# EasyEDA Pro project ProPrj_STM32音响_2025-06-08.epro, schematic Third Test
Board Name: THIRD TEST; Create Date: 2025-04-13; Page Name: 连接电池（保护器）; Project Name: STM32多功能音响; Schematic Name: Schematic3; Update Date: 2025-04-13; Company: 嘉立创EDA; Page Size: A4; Version: V1.0
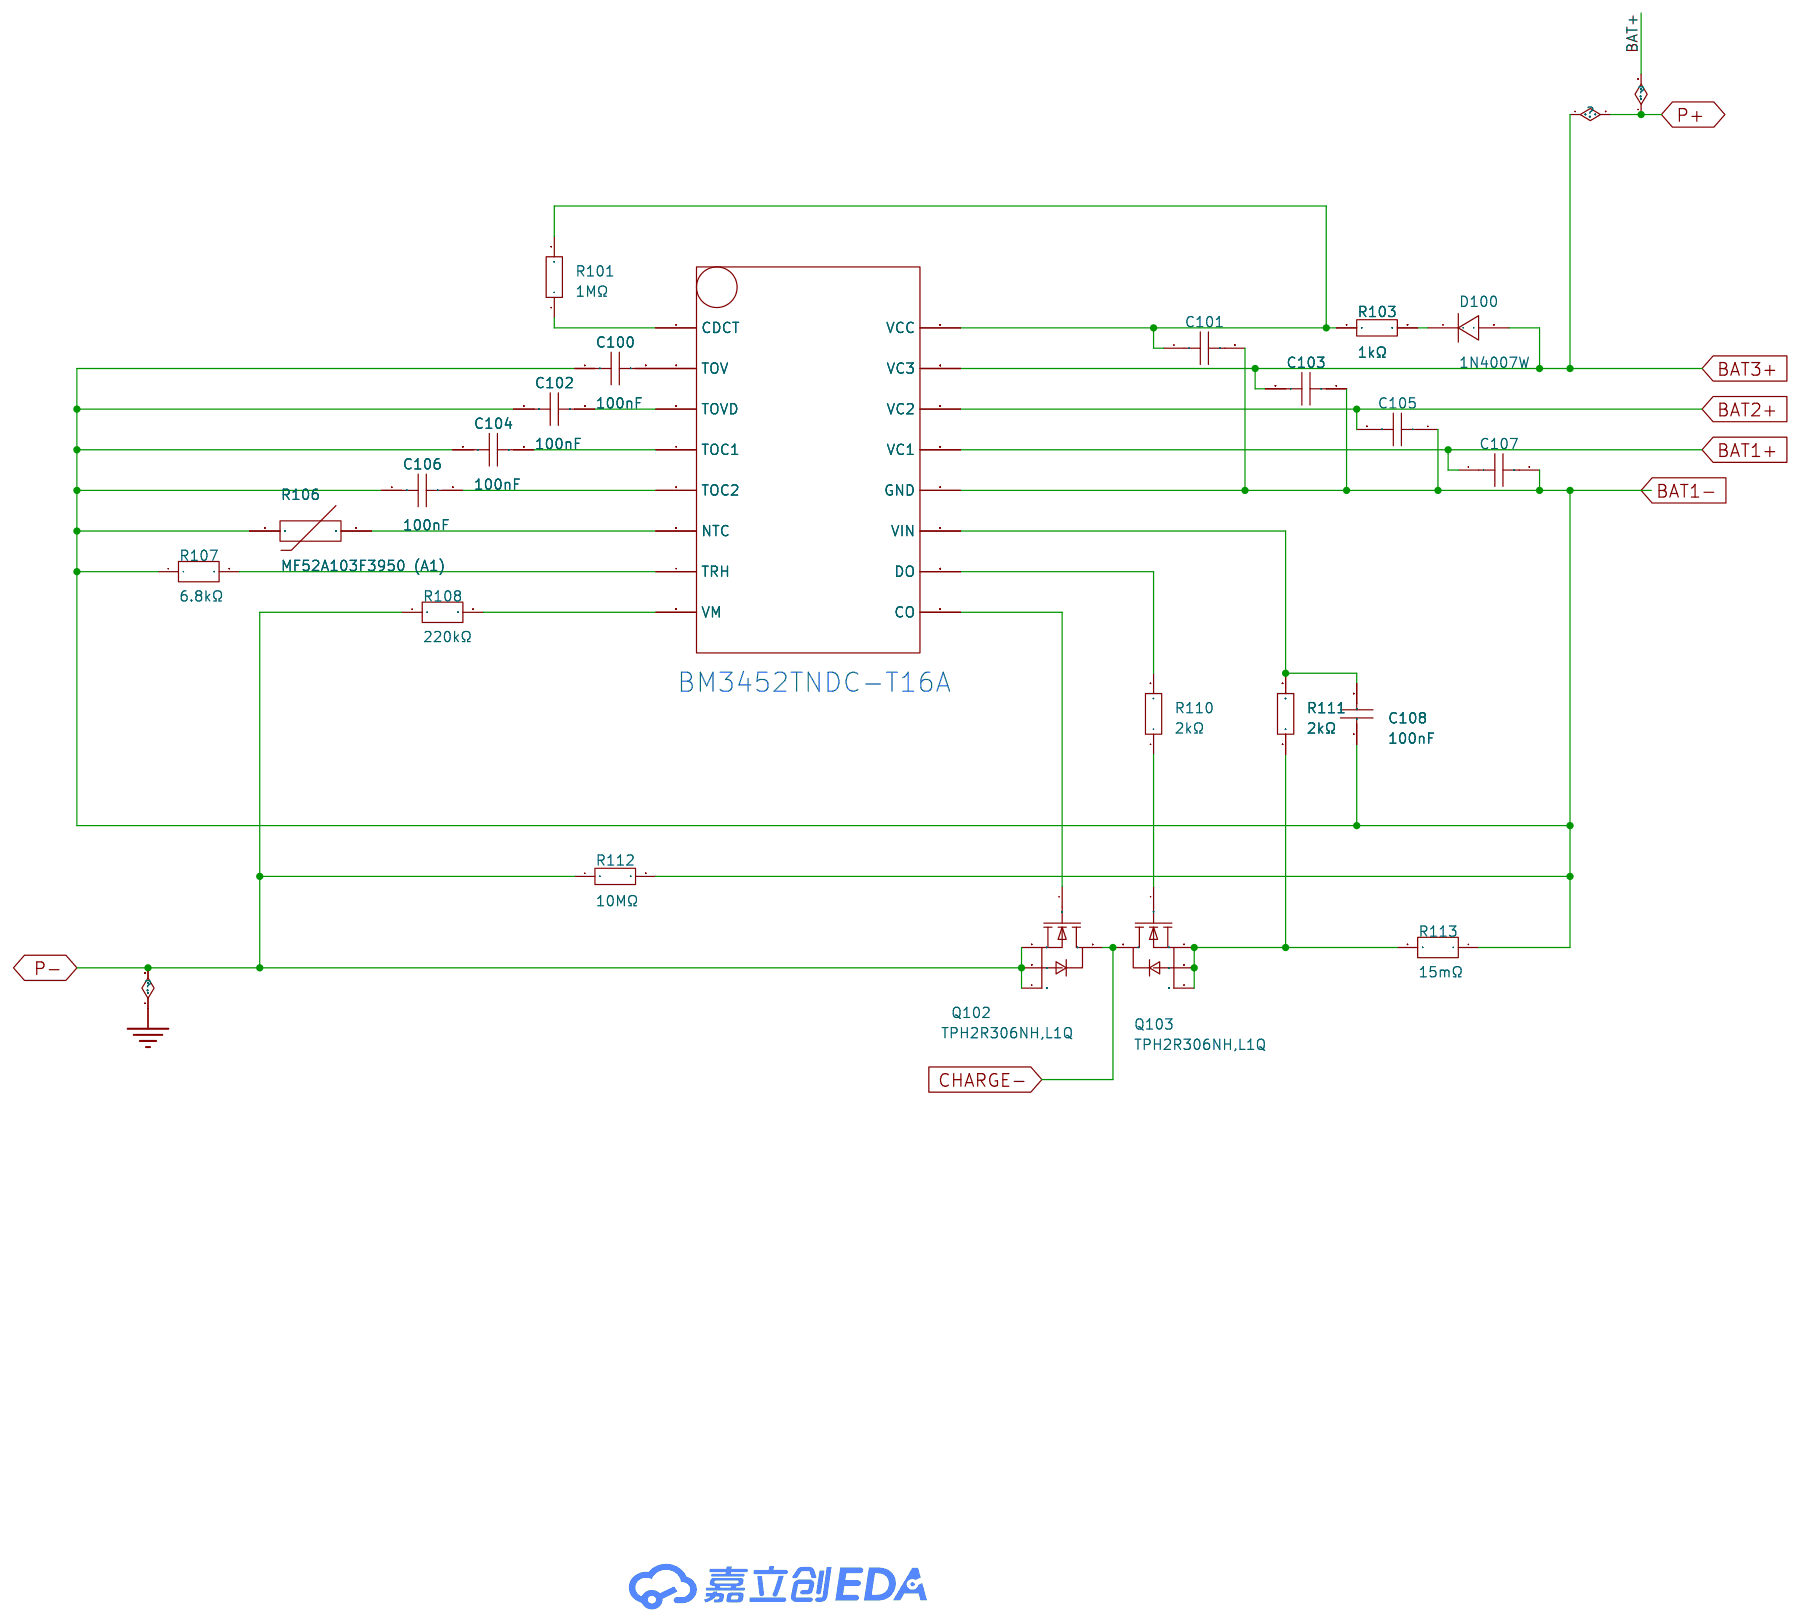
[diagram p11: schematic sheet]

## Parts
C100  100nF  [C0603]
C101  1uF  [C0603]
C102  100nF  [C0603]
C103  100nF  [C0603]
C104  100nF  [C0603]
C105  100nF  [C0603]
C106  100nF  [C0603]
C107  100nF  [C0603]
C108  100nF  [C0603]
D100  1N4007W  [SOD-123FL_L2.7-W1.8-LS3.8-RD]
Q102  TPH2R306NH,L1Q  [DFN-8_L5.0-W5.0-P1.27-LS6.0-EP]
Q103  TPH2R306NH,L1Q  [DFN-8_L5.0-W5.0-P1.27-LS6.0-EP]
R101  1MΩ  [R0603]
R103  1kΩ  [R0603]
R106  MF52A103F3950 (A1)  [RES-TH_L2.5-W2.5-P1.70-D0.3]
R107  6.8kΩ  [R0603]
R108  220kΩ  [R0603]
R110  2kΩ  [R0603]
R111  2kΩ  [R0603]
R112  10MΩ  [R0603]
R113  15mΩ  [RES-SMD_L6.4-W3.2-R2512]
U100  -  [SOP-16_L10.3-W4.4-P1.27-LS7.0-BL]

## Library data of the parts
C100 C102-C107 = CGA0603X7R104K500JT: 容值:100nF;精度:±10%;额定电压:50V;材质(温度系数):X7R;; LCSC Part Name: 100nF ±10% 50V; Supplier Part: C6119867; Manufacturer: HRE(芯声); Supplier Footprint: 0603; JLCPCB Part Class: Extended Part; Supplier: LCSC; Tolerance: ±10%; Voltage Rated: 50V; Temperature Coefficient: X7R
C101 = CL10A105KB8NNNC: 容值:1uF;精度:±10%;额定电压:50V;材质(温度系数):X5R;; LCSC Part Name: 1uF ±10% 50V; Supplier Part: C15849; Manufacturer: SAMSUNG(三星); Supplier Footprint: 0603; JLCPCB Part Class: Basic Part; Datasheet: https://atta.szlcsc.com/upload/public/pdf/source/20160218/1457707763339.pdf; Supplier: LCSC; Tolerance: ±10%; Voltage Rated: 50V; Temperature Coefficient: X5R
C108 = CGA0603X7R104K500JT: 容值:100nF;精度:±10%;额定电压:50V;温度系数:X7R;; LCSC Part Name: 100nF ±10% 50V; Supplier Part: C6119867; Manufacturer: HRE(芯声); Supplier Footprint: 0603; JLCPCB Part Class: Extended Part; Datasheet: https://atta.szlcsc.com/upload/public/pdf/source/20250103/C44077DA9E7B3EFAE02F22B6D3D1CBC9.pdf; Supplier: LCSC; Tolerance: ±10%; Voltage Rated: 50V; Temperature Coefficient: X7R; Voltage Rating: 50V
D100 = 1N4007W_C18199088: 二极管配置:独立式;正向压降(Vf):1V@1.0A;直流反向耐压(Vr):1kV;整流电流:1A;; Supplier Part: C18199088; Manufacturer: 宏迦橙; Supplier Footprint: SOD-123FL; JLCPCB Part Class: 扩展库; Datasheet: https://atta.szlcsc.com/upload/public/pdf/source/20230925/B0AB2B510D392D7083D021E804ED238F.pdf; Supplier: LCSC; Diode Configuration: 独立式; Forward Voltage (Vf@If): 1V@1.0A; Reverse Voltage (Vr): 1kV; Rectified Current: 1A; Reverse Leakage Current (Ir): 2uA@1000V
Q102 Q103 = TPH2R306NH,L1Q: 类型:1个N沟道;漏源电压(Vdss):60V;连续漏极电流(Id):130A;导通电阻(RDS(on)@Vgs,Id):1.9mΩ@10V,30A;功率(Pd):78W;阈值电压(Vgs(th)@Id):4V@1.0mA;; LCSC Part Name: 1个N沟道 耐压:60V 电流:130A; Supplier Part: C146343; Manufacturer: TOSHIBA(东芝); Supplier Footprint: VDFN-8(5x5); JLCPCB Part Class: 扩展库; Datasheet: https://atta.szlcsc.com/upload/public/pdf/source/20230529/77DDCF78FE52467FC52662B5372759F6.pdf; Supplier: LCSC; Type: 1个N沟道; Drain Source Voltage (Vdss): 60V; Continuous Drain Current (Id): 130A; Drain Source On Resistance (RDS(on)@Vgs,Id): 1.9mΩ@10V,30A; Power Dissipation (Pd): 78W; Gate Threshold Voltage (Vgs(th)@Id): 4V@1.0mA; Total Gate Charge (Qg@Vgs): 72nC@10V; Input Capacitance (Ciss@Vds): 6.1nF@30V; Reverse Transfer Capacitance (Crss@Vds): 100pF@30V; Operating Temperature: -55℃~+150℃
R101 = 0603WAF1004T5E: 电阻类型:厚膜电阻;阻值:1MΩ;精度:±1%;功率:100mW;最大工作电压:75V;温度系数:±100ppm/℃;; LCSC Part Name: 1MΩ ±1% 100mW 厚膜电阻; Supplier Part: C22935; Manufacturer: UNI-ROYAL(厚声); Supplier Footprint: 0603; JLCPCB Part Class: 基础库; Datasheet: https://atta.szlcsc.com/upload/public/pdf/source/20200306/C422600_1E6D84923E4A46A82E41ADD87F860B5C.pdf; Supplier: LCSC; Type: 厚膜电阻; Tolerance: ±1%; Power(Watts): 100mW; Overload Voltage (Max): 75V; Temperature Coefficient: ±100ppm/℃; Operating Temperature Range: -55℃~+155℃
R103 = 0603WAF1001T5E: 电阻类型:厚膜电阻;阻值:1kΩ;精度:±1%;功率:100mW;最大工作电压:75V;温度系数:±100ppm/℃;; LCSC Part Name: 1kΩ ±1% 100mW 厚膜电阻; Supplier Part: C21190; Manufacturer: UNI-ROYAL(厚声); Supplier Footprint: 0603; JLCPCB Part Class: Basic Part; Datasheet: https://atta.szlcsc.com/upload/public/pdf/source/20200306/C422600_1E6D84923E4A46A82E41ADD87F860B5C.pdf; Supplier: LCSC; Type: 厚膜电阻; Tolerance: ±1%; Power(Watts): 100mW; Overload Voltage (Max): 75V; Temperature Coefficient: ±100ppm/℃; Operating Temperature Range: -55℃~+155℃
R106 = MF52A103F3950 (A1): 阻值(25℃):10kΩ;B值(25℃/50℃):3950K;电阻精度:±1%;功率:50mW;B值精度:±1%;最大稳态电流(25℃):-;; LCSC Part Name: 10kΩ 电阻精度:±1% 3950K; Supplier Part: C13879; Manufacturer: 时恒; Supplier Footprint: 插件,P=1.7mm; JLCPCB Part Class: 扩展库; Datasheet: https://atta.szlcsc.com/upload/public/pdf/source/20181018/C324070_6015F64EA824A635FDB9BBFA1E1FD5FE.pdf; Supplier: LCSC; Resistance @ 25℃: 10kΩ; B Constant (25℃/50℃): 3950K; Resistance Tolerance: ±1%; Power: 50mW; B Constant Tolerance: ±1%; Operating Temperature: -55℃~+125℃
R107 = FRC0603F6801TS: 电阻类型:厚膜电阻;阻值:6.8kΩ;精度:±1%;功率:100mW;最大工作电压:75V;温度系数:±100ppm/℃;; LCSC Part Name: 6.8kΩ ±1% 100mW 厚膜电阻; Supplier Part: C2907055; Manufacturer: FOJAN(富捷); Supplier Footprint: 0603; JLCPCB Part Class: 扩展库; Datasheet: https://atta.szlcsc.com/upload/public/pdf/source/20211221/925EC7D7225764EE0046F22065062C87.pdf; Supplier: LCSC; Type: 厚膜电阻; Tolerance: ±1%; Power(Watts): 100mW; Overload Voltage (Max): 75V; Temperature Coefficient: ±100ppm/℃; Operating Temperature Range: -55℃~+155℃
R108 = FRC0603F2203TS: 电阻类型:厚膜电阻;阻值:220kΩ;精度:±1%;功率:100mW;工作电压:75V;温度系数:±100ppm/℃;; LCSC Part Name: 220kΩ ±1% 100mW 厚膜电阻; Supplier Part: C2907013; Manufacturer: FOJAN(富捷); Supplier Footprint: 0603; JLCPCB Part Class: 扩展库; Datasheet: https://atta.szlcsc.com/upload/public/pdf/source/20211221/925EC7D7225764EE0046F22065062C87.pdf; Supplier: LCSC; Type: 厚膜电阻; Tolerance: ±1%; Power(Watts): 100mW; Voltage-Supply(Max): 75V; Temperature Coefficient: ±100ppm/℃; Operating Temperature: -55℃~+155℃
R110 R111 = 0603WAF2001T5E: 电阻类型:厚膜电阻;阻值:2kΩ;精度:±1%;功率:100mW;最大工作电压:75V;温度系数:±100ppm/℃;; LCSC Part Name: 2kΩ ±1% 100mW 厚膜电阻; Supplier Part: C22975; Manufacturer: UNI-ROYAL(厚声); Supplier Footprint: 0603; JLCPCB Part Class: 基础库; Datasheet: https://atta.szlcsc.com/upload/public/pdf/source/20200306/C422600_1E6D84923E4A46A82E41ADD87F860B5C.pdf; Supplier: LCSC; Type: 厚膜电阻; Tolerance: ±1%; Power(Watts): 100mW; Overload Voltage (Max): 75V; Temperature Coefficient: ±100ppm/℃; Operating Temperature Range: -55℃~+155℃
R112 = RC0603FR-0710ML: 电阻类型:厚膜电阻;阻值:10MΩ;精度:±1%;功率:100mW;最大工作电压:75V;温度系数:±100ppm/℃;; LCSC Part Name: 厚膜电阻 10MΩ ±1% 100mW; Supplier Part: C114606; Manufacturer: YAGEO(国巨); Supplier Footprint: 0603; JLCPCB Part Class: 扩展库; Datasheet: https://atta.szlcsc.com/upload/public/pdf/source/20180821/C275644_0D56F95EFF785E7D9A1FEF436B37DA78.pdf; Supplier: LCSC; Type: 厚膜电阻; Tolerance: ±1%; Power(Watts): 100mW; Overload Voltage (Max): 75V; Temperature Coefficient: ±100ppm/℃; Operating Temperature Range: -55℃~+155℃
R113 = HoLLR2512-3W-15mR-1%: 电阻类型:采样电阻;阻值:15mΩ;精度:±1%;额定压降:-;功率:3W;温度系数:±50ppm/℃;安装方式:贴片;; LCSC Part Name: 15mΩ ±1% 3W; Supplier Part: C2985715; Manufacturer: Milliohm(毫欧); Supplier Footprint: 2512; JLCPCB Part Class: Extended Part; Datasheet: https://atta.szlcsc.com/upload/public/pdf/source/20220124/F3D873CF201F5DDE540D06325246BEDC.pdf; Supplier: LCSC; Type: 采样电阻; Tolerance: ±1%; Power(Watts): 3W; Rated Current: 77.5A; Temperature Coefficient: ±50ppm/℃; Mounting Sytle: 贴片
U100 = BM3452: 比亚迪的电池管理芯片

## Nets
GND: Q102.1(S) Q102.2(S) Q102.3(S) R108.1 R112.1
BAT1+: C107.1 U100.13(VC1)
BAT1-: C100.1 C101.2 C102.1 C103.1 C104.1 C105.1 C106.1 C107.2 C108.1 R106.1 R107.1 R112.2 R113.1 U100.12(GND)
BAT2+: C105.2 U100.14(VC2)
BAT+: C103.2 D100.2(A) U100.15(VC3)
CHARGE-: Q102.5(D) Q103.5(D)
$1N1279: D100.1(K) R103.2
$1N1280: C100.2 U100.2(TOV)
$1N1281: R101.1 U100.1(CDCT)
$1N1282: C101.1 R101.2 R103.1 U100.16(VCC)
$1N1286: C102.2 U100.3(TOVD)
$1N1287: C104.2 U100.4(TOC1)
$1N1288: C106.2 U100.5(TOC2)
$1N1289: R106.2 U100.6(NTC)
$1N1290: R107.2 U100.7(TRH)
$1N1291: R108.2 U100.8(VM)
$1N1294: R110.2 U100.10(DO)
$1N1295: C108.2 R111.2 U100.11(VIN)
$1N1536: Q103.1(S) Q103.2(S) Q103.3(S) R111.1 R113.2
$1N1538: Q103.4(G) R110.1
$1N1542: Q102.4(G) U100.9(CO)
